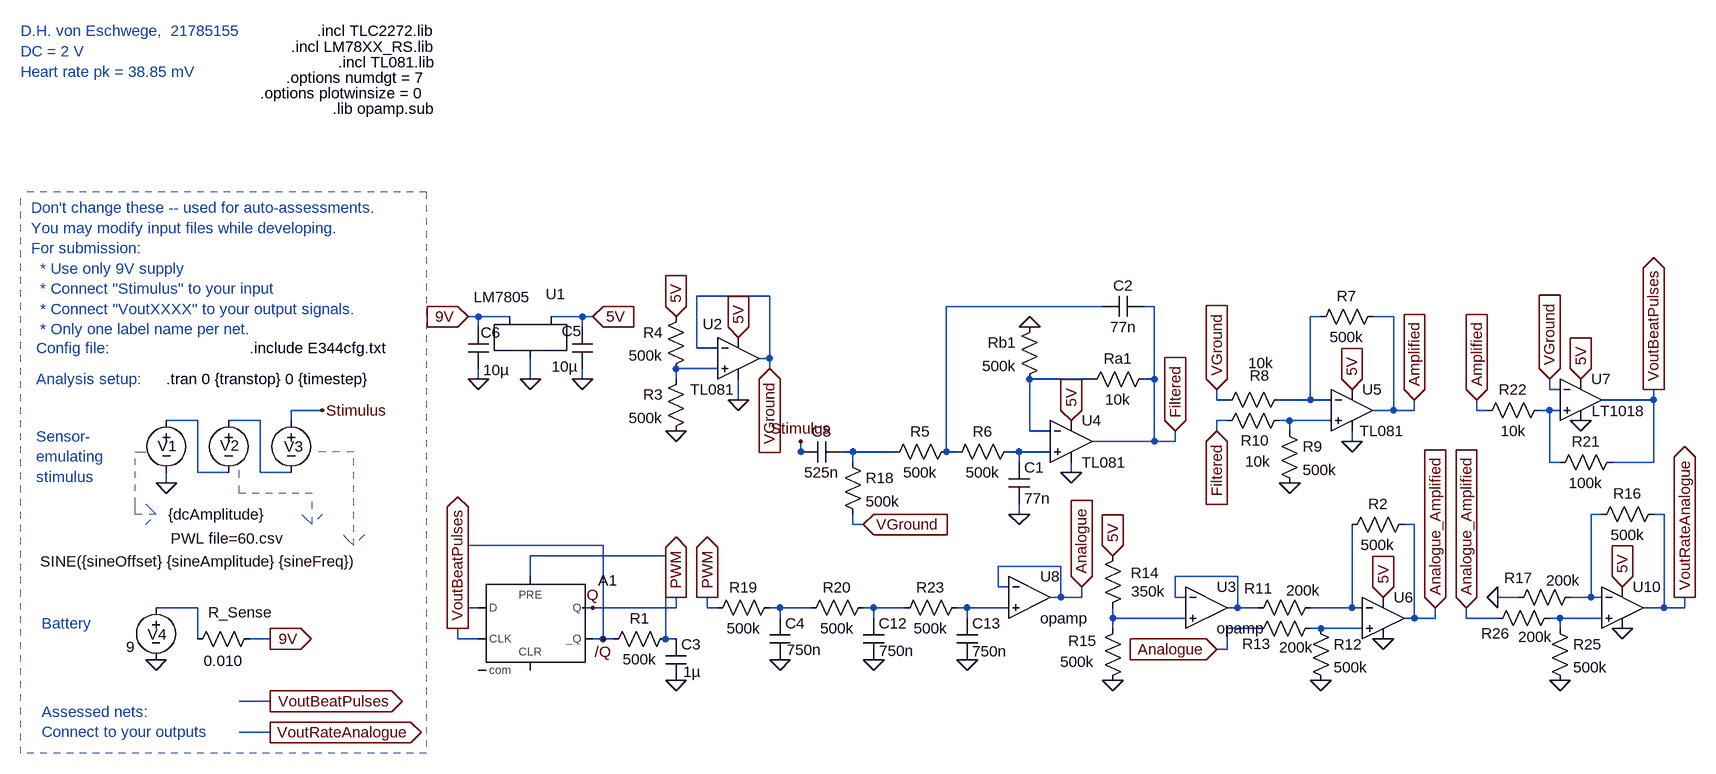
[diagram p0: schematic von_Eschwege_21785155_A2.asc]
von_Eschwege_21785155_A2.asc, the LTspice schematic file:
Version 4
SHEET 1 2292 680
WIRE -1152 -1248 -1264 -1248
WIRE -640 -1232 -880 -1232
WIRE -560 -1232 -576 -1232
WIRE -1600 -1216 -1616 -1216
WIRE -1552 -1216 -1600 -1216
WIRE -1440 -1216 -1488 -1216
WIRE -1424 -1216 -1440 -1216
WIRE -304 -1216 -320 -1216
WIRE -192 -1216 -224 -1216
WIRE -1600 -1200 -1600 -1216
WIRE -1440 -1200 -1440 -1216
WIRE -1264 -1168 -1264 -1248
WIRE -1232 -1168 -1264 -1168
WIRE -1152 -1152 -1152 -1248
WIRE -1152 -1152 -1168 -1152
WIRE -1232 -1136 -1296 -1136
WIRE -1152 -1136 -1152 -1152
WIRE -1600 -1120 -1600 -1136
WIRE -1520 -1120 -1520 -1152
WIRE -1440 -1120 -1440 -1136
WIRE -1296 -1120 -1296 -1136
WIRE -656 -1120 -752 -1120
WIRE -560 -1120 -560 -1232
WIRE -560 -1120 -576 -1120
WIRE 48 -1104 48 -1120
WIRE 64 -1104 48 -1104
WIRE -1200 -1088 -1200 -1120
WIRE -464 -1088 -464 -1104
WIRE -448 -1088 -464 -1088
WIRE -320 -1088 -320 -1216
WIRE -320 -1088 -368 -1088
WIRE -288 -1088 -320 -1088
WIRE 208 -1088 208 -1104
WIRE 208 -1088 128 -1088
WIRE -1840 -1072 -1888 -1072
WIRE -192 -1072 -192 -1216
WIRE -192 -1072 -224 -1072
WIRE -160 -1072 -160 -1088
WIRE -160 -1072 -192 -1072
WIRE -64 -1072 -64 -1088
WIRE -48 -1072 -64 -1072
WIRE 48 -1072 32 -1072
WIRE 64 -1072 48 -1072
WIRE -2032 -1056 -2080 -1056
WIRE -1936 -1056 -1984 -1056
WIRE -1888 -1056 -1888 -1072
WIRE -448 -1056 -464 -1056
WIRE -352 -1056 -368 -1056
WIRE -288 -1056 -352 -1056
WIRE -752 -1040 -752 -1120
WIRE -720 -1040 -752 -1040
WIRE -464 -1040 -464 -1056
WIRE -352 -1040 -352 -1056
WIRE -560 -1024 -560 -1120
WIRE -560 -1024 -656 -1024
WIRE -528 -1024 -528 -1040
WIRE -528 -1024 -560 -1024
WIRE -256 -1024 -256 -1040
WIRE -1104 -1008 -1104 -1024
WIRE -1088 -1008 -1104 -1008
WIRE -1024 -1008 -1040 -1008
WIRE -960 -1008 -1024 -1008
WIRE -880 -1008 -880 -1232
WIRE -864 -1008 -880 -1008
WIRE -768 -1008 -784 -1008
WIRE -720 -1008 -768 -1008
WIRE -1024 -992 -1024 -1008
WIRE -768 -992 -768 -1008
WIRE 48 -992 48 -1072
WIRE 64 -992 48 -992
WIRE 208 -992 208 -1088
WIRE 208 -992 144 -992
WIRE -2032 -976 -2032 -1056
WIRE -1984 -976 -2032 -976
WIRE -1936 -976 -1936 -1056
WIRE -1888 -976 -1936 -976
WIRE -688 -976 -688 -992
WIRE -2080 -960 -2080 -976
WIRE -768 -912 -768 -928
WIRE 128 -912 112 -912
WIRE 224 -912 208 -912
WIRE -1024 -896 -1024 -912
WIRE -1008 -896 -1024 -896
WIRE -160 -896 -176 -896
WIRE -1408 -864 -1616 -864
WIRE -1312 -848 -1520 -848
WIRE -704 -832 -800 -832
WIRE -1520 -816 -1520 -848
WIRE -432 -816 -528 -816
WIRE -800 -800 -800 -832
WIRE -784 -800 -800 -800
WIRE -704 -784 -704 -832
WIRE -704 -784 -720 -784
WIRE -672 -784 -672 -800
WIRE -672 -784 -704 -784
WIRE -528 -784 -528 -816
WIRE -512 -784 -528 -784
WIRE 0 -784 -32 -784
WIRE 112 -784 112 -912
WIRE 112 -784 80 -784
WIRE 128 -784 112 -784
WIRE -2032 -768 -2096 -768
WIRE -1616 -768 -1616 -864
WIRE -1600 -768 -1616 -768
WIRE -1424 -768 -1440 -768
WIRE -1296 -768 -1296 -784
WIRE -1296 -768 -1424 -768
WIRE -1248 -768 -1248 -784
WIRE -1232 -768 -1248 -768
WIRE -1136 -768 -1152 -768
WIRE -1088 -768 -1136 -768
WIRE -992 -768 -1008 -768
WIRE -944 -768 -992 -768
WIRE -848 -768 -864 -768
WIRE -784 -768 -848 -768
WIRE -432 -768 -432 -816
WIRE -432 -768 -448 -768
WIRE -400 -768 -432 -768
WIRE -256 -768 -256 -896
WIRE -256 -768 -320 -768
WIRE -240 -768 -256 -768
WIRE 224 -768 224 -912
WIRE 224 -768 192 -768
WIRE 256 -768 256 -784
WIRE 256 -768 224 -768
WIRE -1136 -752 -1136 -768
WIRE -992 -752 -992 -768
WIRE -848 -752 -848 -768
WIRE -624 -752 -624 -768
WIRE -512 -752 -624 -752
WIRE -160 -752 -160 -896
WIRE -160 -752 -176 -752
WIRE -128 -752 -128 -768
WIRE -128 -752 -160 -752
WIRE -80 -752 -80 -768
WIRE -32 -752 -80 -752
WIRE 64 -752 48 -752
WIRE 128 -752 64 -752
WIRE -624 -736 -624 -752
WIRE -400 -736 -448 -736
WIRE -304 -736 -320 -736
WIRE -240 -736 -304 -736
WIRE 64 -736 64 -752
WIRE -2032 -720 -2032 -768
WIRE -1920 -720 -1952 -720
WIRE -1632 -720 -1632 -736
WIRE -1600 -720 -1632 -720
WIRE -1408 -720 -1408 -864
WIRE -1408 -720 -1424 -720
WIRE -1392 -720 -1408 -720
WIRE -1312 -720 -1312 -848
WIRE -1296 -720 -1312 -720
WIRE -448 -704 -448 -736
WIRE -448 -704 -464 -704
WIRE -1920 -624 -1968 -624
WIRE -1920 -576 -1968 -576
FLAG -2080 -960 0
FLAG -1840 -1072 Stimulus
FLAG -1920 -720 9V
IOPIN -1920 -720 Out
FLAG -2096 -688 0
FLAG -1920 -624 VoutBeatPulses
IOPIN -1920 -624 Out
FLAG -1920 -576 VoutRateAnalogue
IOPIN -1920 -576 Out
FLAG -1520 -1120 0
FLAG -1616 -1216 9V
IOPIN -1616 -1216 In
FLAG -1600 -1120 0
FLAG -1440 -1120 0
FLAG -1424 -1216 5V
IOPIN -1424 -1216 In
FLAG -1296 -1040 0
FLAG -1296 -1216 5V
IOPIN -1296 -1216 In
FLAG -1200 -1088 0
FLAG -1200 -1184 5V
IOPIN -1200 -1184 In
FLAG -1152 -1136 VGround
IOPIN -1152 -1136 In
FLAG -688 -976 0
FLAG -768 -912 0
FLAG -752 -1200 0
FLAG -688 -1056 5V
IOPIN -688 -1056 In
FLAG -256 -1024 0
FLAG -352 -960 0
FLAG -256 -1104 5V
IOPIN -256 -1104 In
FLAG 96 -1120 5V
IOPIN 96 -1120 In
FLAG 96 -1056 0
FLAG -1104 -1024 Stimulus
FLAG -1008 -896 VGround
IOPIN -1008 -896 In
FLAG 208 -1104 VoutBeatPulses
IOPIN 208 -1104 Out
FLAG -1424 -768 Q
FLAG -1408 -720 /Q
FLAG -1296 -656 0
FLAG -1632 -736 VoutBeatPulses
IOPIN -1632 -736 Out
FLAG -528 -1040 Filtered
IOPIN -528 -1040 In
FLAG -464 -1040 Filtered
IOPIN -464 -1040 In
FLAG -160 -1088 Amplified
IOPIN -160 -1088 In
FLAG -64 -1088 Amplified
IOPIN -64 -1088 In
FLAG -464 -1104 VGround
IOPIN -464 -1104 In
FLAG 48 -1120 VGround
IOPIN 48 -1120 In
FLAG -1296 -784 PWM
IOPIN -1296 -784 Out
FLAG -1136 -688 0
FLAG -992 -688 0
FLAG -848 -688 0
FLAG -672 -800 Analogue
IOPIN -672 -800 In
FLAG -1248 -784 PWM
IOPIN -1248 -784 Out
FLAG -304 -656 0
FLAG -464 -704 Analogue
IOPIN -464 -704 In
FLAG -624 -656 0
FLAG -208 -784 5V
IOPIN -208 -784 In
FLAG -208 -720 0
FLAG -624 -848 5V
IOPIN -624 -848 In
FLAG 64 -656 0
FLAG 256 -784 VoutRateAnalogue
IOPIN 256 -784 Out
FLAG 160 -800 5V
IOPIN 160 -800 In
FLAG 160 -736 0
FLAG -128 -768 Analogue_Amplified
IOPIN -128 -768 In
FLAG -32 -784 0
FLAG -80 -768 Analogue_Amplified
IOPIN -80 -768 In
SYMBOL voltage -1984 -1072 R0
WINDOW 123 0 0 Left 0
WINDOW 39 0 0 Left 0
WINDOW 3 -89 197 Left 2
WINDOW 0 -13 54 Left 2
SYMATTR Value PWL file=60.csv
SYMATTR InstName V2
SYMBOL voltage -1888 -1072 R0
WINDOW 123 24 44 Left 2
WINDOW 39 0 0 Left 0
WINDOW 3 -386 233 Left 2
WINDOW 0 -11 56 Left 2
SYMATTR Value SINE({sineOffset} {sineAmplitude} {sineFreq})
SYMATTR InstName V3
SYMBOL voltage -2080 -1072 R0
WINDOW 123 0 0 Left 0
WINDOW 39 0 0 Left 0
WINDOW 3 3 160 Left 2
WINDOW 0 -13 55 Left 2
SYMATTR Value {dcAmplitude}
SYMATTR InstName V1
SYMBOL voltage -2096 -784 R0
WINDOW 123 24 44 Left 2
WINDOW 39 0 0 Left 0
WINDOW 3 -46 76 Left 2
WINDOW 0 -13 57 Left 2
SYMATTR Value 9
SYMATTR InstName V4
SYMBOL res -1936 -736 R90
WINDOW 0 -9 30 VBottom 2
WINDOW 3 34 56 VTop 2
SYMATTR InstName R_Sense
SYMATTR Value 0.010
SYMBOL LM7805 -1520 -1200 R0
WINDOW 0 39 -35 Bottom 2
WINDOW 3 -43 -62 Top 2
SYMATTR InstName U1
SYMBOL cap -1456 -1200 R0
WINDOW 0 -16 6 Left 2
WINDOW 3 -31 61 Left 2
SYMATTR InstName C5
SYMATTR Value 10µ
SYMBOL cap -1584 -1200 M0
WINDOW 0 -18 8 Left 2
WINDOW 3 -32 66 Left 2
SYMATTR InstName C6
SYMATTR Value 10µ
SYMBOL res -1280 -1136 M0
SYMATTR InstName R3
SYMATTR Value 500k
SYMBOL res -1280 -1232 M0
SYMATTR InstName R4
SYMATTR Value 500k
SYMBOL Opamps\\opamp2 -1200 -1216 R0
WINDOW 0 -55 11 Left 2
WINDOW 3 -74 112 Left 2
SYMATTR InstName U2
SYMATTR Value TL081
SYMBOL res -864 -1024 R90
WINDOW 0 0 56 VBottom 2
WINDOW 3 32 56 VTop 2
SYMATTR InstName R5
SYMATTR Value 500k
SYMBOL cap -784 -992 R0
SYMATTR InstName C1
SYMATTR Value 77n
SYMBOL Opamps\\opamp2 -688 -1088 R0
SYMATTR InstName U4
SYMATTR Value TL081
SYMBOL res -768 -1024 R90
WINDOW 0 0 56 VBottom 2
WINDOW 3 32 56 VTop 2
SYMATTR InstName R6
SYMATTR Value 500k
SYMBOL res -560 -1136 R90
WINDOW 0 0 56 VBottom 2
WINDOW 3 32 56 VTop 2
SYMATTR InstName Ra1
SYMATTR Value 10k
SYMBOL res -736 -1216 M0
SYMATTR InstName Rb1
SYMATTR Value 500k
SYMBOL cap -576 -1248 R90
WINDOW 0 0 32 VBottom 2
WINDOW 3 32 32 VTop 2
SYMATTR InstName C2
SYMATTR Value 77n
SYMBOL res -208 -1232 R90
WINDOW 0 0 56 VBottom 2
WINDOW 3 32 56 VTop 2
SYMATTR InstName R7
SYMATTR Value 500k
SYMBOL res -352 -1104 R90
WINDOW 0 -6 46 VBottom 2
WINDOW 3 -56 44 VTop 2
SYMATTR InstName R8
SYMATTR Value 10k
SYMBOL Opamps\\opamp2 -256 -1136 R0
WINDOW 3 12 96 Left 2
SYMATTR Value TL081
SYMATTR InstName U5
SYMBOL res -368 -1056 R0
SYMATTR InstName R9
SYMATTR Value 500k
SYMBOL res -352 -1072 R90
WINDOW 0 62 53 VBottom 2
WINDOW 3 63 49 VTop 2
SYMATTR InstName R10
SYMATTR Value 10k
SYMBOL Comparators\\LT1018 96 -1088 R0
WINDOW 3 17 17 Left 2
SYMATTR InstName U7
SYMBOL cap -1040 -992 M270
WINDOW 0 32 32 VTop 2
WINDOW 3 0 32 VBottom 2
SYMATTR InstName C8
SYMATTR Value 525n
SYMBOL res -1040 -1008 R0
SYMATTR InstName R18
SYMATTR Value 500k
SYMBOL res 160 -1008 R90
WINDOW 0 0 56 VBottom 2
WINDOW 3 32 56 VTop 2
SYMATTR InstName R21
SYMATTR Value 100k
SYMBOL res 48 -1088 R90
WINDOW 0 0 56 VBottom 2
WINDOW 3 32 56 VTop 2
SYMATTR InstName R22
SYMATTR Value 10k
SYMBOL Digital\\dflop -1520 -816 R0
SYMATTR InstName A1
SYMATTR SpiceLine Vhigh 5 Trise 10n
SYMBOL res -1296 -736 R90
WINDOW 0 0 56 VBottom 2
WINDOW 3 32 56 VTop 2
SYMATTR InstName R1
SYMATTR Value 500k
SYMBOL cap -1312 -720 R0
WINDOW 3 27 51 Left 2
SYMATTR Value 1µ
SYMATTR InstName C3
SYMBOL res -1136 -784 R90
WINDOW 0 0 56 VBottom 2
WINDOW 3 32 56 VTop 2
SYMATTR InstName R19
SYMATTR Value 500k
SYMBOL cap -1152 -752 R0
WINDOW 3 26 49 Left 2
SYMATTR Value 750n
SYMATTR InstName C4
SYMBOL res -992 -784 R90
WINDOW 0 0 56 VBottom 2
WINDOW 3 32 56 VTop 2
SYMATTR InstName R20
SYMATTR Value 500k
SYMBOL cap -1008 -752 R0
WINDOW 3 25 50 Left 2
SYMATTR Value 750n
SYMATTR InstName C12
SYMBOL res -848 -784 R90
WINDOW 0 0 56 VBottom 2
WINDOW 3 32 56 VTop 2
SYMATTR InstName R23
SYMATTR Value 500k
SYMBOL cap -864 -752 R0
WINDOW 3 24 51 Left 2
SYMATTR Value 750n
SYMATTR InstName C13
SYMBOL res -160 -912 R90
WINDOW 0 0 56 VBottom 2
WINDOW 3 32 56 VTop 2
SYMATTR InstName R2
SYMATTR Value 500k
SYMBOL res -304 -784 R90
WINDOW 0 2 96 VBottom 2
WINDOW 3 -26 27 VTop 2
SYMATTR InstName R11
SYMATTR Value 200k
SYMBOL res -320 -752 R0
SYMATTR InstName R12
SYMATTR Value 500k
SYMBOL res -304 -752 R90
WINDOW 0 55 99 VBottom 2
WINDOW 3 29 38 VTop 2
SYMATTR InstName R13
SYMATTR Value 200k
SYMBOL res -608 -864 M0
WINDOW 0 -56 42 Left 2
WINDOW 3 -65 71 Left 2
SYMATTR InstName R14
SYMATTR Value 350k
SYMATTR SpiceLine tol=60k
SYMBOL res -608 -752 M0
WINDOW 0 40 35 Left 2
WINDOW 3 44 67 Left 2
SYMATTR InstName R15
SYMATTR Value 500k
SYMBOL OpAmps\\opamp -480 -832 R0
SYMATTR InstName U3
SYMBOL OpAmps\\UniversalOpamp2 -208 -752 R0
SYMATTR InstName U6
SYMBOL OpAmps\\opamp -752 -848 R0
SYMATTR InstName U8
SYMBOL res 224 -928 R90
WINDOW 0 0 56 VBottom 2
WINDOW 3 32 56 VTop 2
SYMATTR InstName R16
SYMATTR Value 500k
SYMBOL res 96 -800 R90
WINDOW 0 2 96 VBottom 2
WINDOW 3 -26 27 VTop 2
SYMATTR InstName R17
SYMATTR Value 200k
SYMBOL res 48 -752 R0
SYMATTR InstName R25
SYMATTR Value 500k
SYMBOL res 64 -768 R90
WINDOW 0 55 99 VBottom 2
WINDOW 3 29 38 VTop 2
SYMATTR InstName R26
SYMATTR Value 200k
SYMBOL OpAmps\\UniversalOpamp2 160 -768 R0
SYMATTR InstName U10
TEXT -2080 -1120 Left 2 !.tran 0 {transtop} 0 {timestep}
TEXT -1952 -1168 Left 2 !.include E344cfg.txt
TEXT -2288 -1384 Left 2 ;Don't change these -- used for auto-assessments.\nYou may modify input files while developing.\nFor submission: \n  * Use only 9V supply \n  * Connect "Stimulus" to your input\n  * Connect "VoutXXXX" to your output signals.\n  * Only one label name per net.
TEXT -2280 -1168 Left 2 ;Config file:
TEXT -2280 -1120 Left 2 ;Analysis setup:
TEXT -2272 -744 Left 2 ;Battery
TEXT -2280 -1032 Left 2 ;Sensor-\nemulating \nstimulus
TEXT -2272 -608 Left 2 ;Assessed nets:\nConnect to your outputs
TEXT -2304 -1656 Left 2 ;D.H. von Eschwege,  21785155\nDC = 2 V\nHeart rate pk = 38.85 mV
TEXT -1848 -1656 Left 2 !.incl TLC2272.lib
TEXT -1888 -1632 Left 2 !.incl LM78XX_RS.lib
TEXT -1816 -1608 Left 2 !.incl TL081.lib
TEXT -1896 -1584 Left 2 !.options numdgt = 7
TEXT -1936 -1560 Left 2 !.options plotwinsize = 0
TEXT -1824 -1536 Left 2 !.lib opamp.sub
LINE Normal -1792 -1008 -1856 -1008 2
LINE Normal -1792 -864 -1792 -1008 2
LINE Normal -1808 -880 -1792 -864 2
LINE Normal -1792 -864 -1808 -880 2
LINE Normal -1776 -880 -1792 -864 2
LINE Normal -2128 -1008 -2112 -1008 2
LINE Normal -2128 -928 -2128 -1008 2
LINE Normal -2128 -912 -2128 -928 2
LINE Normal -2096 -912 -2128 -912 2
LINE Normal -2112 -928 -2096 -912 2
LINE Normal -2096 -912 -2112 -928 2
LINE Normal -2112 -896 -2096 -912 2
LINE Normal -1968 -944 -1968 -992 2
LINE Normal -1856 -944 -1968 -944 2
LINE Normal -1856 -896 -1856 -944 2
LINE Normal -1872 -912 -1856 -896 2
LINE Normal -1856 -896 -1872 -912 2
LINE Normal -1840 -912 -1856 -896 2
LINE Normal -2304 -544 -2304 -1408 1
LINE Normal -1680 -1408 -1680 -544 1
LINE Normal -1680 -544 -2304 -544 1
LINE Normal -1680 -1408 -2304 -1408 1

The netlist it stands for:
* von_Eschwege_21785155_A2.asc
V2 N007 N006 PWL file=60.csv
V3 Stimulus N007 SINE({sineOffset} {sineAmplitude} {sineFreq})
V1 N006 0 {dcAmplitude}
V4 N014 0 9
R_Sense 9V N014 0.010
XU1 9V 0 5V LM7805
C5 5V 0 10µ
C6 9V 0 10µ
R3 N003 0 500k
R4 5V N003 500k
XU2 N003 VGround 5V 0 VGround TL081  ; pins In+ In- V+ V- OUT
R5 N001 N009 500k
C1 N010 0 77n
XU4 N010 N004 5V 0 Filtered TL081  ; pins In+ In- V+ V- OUT
R6 N010 N001 500k
Ra1 Filtered N004 10k
Rb1 0 N004 500k
C2 Filtered N001 77n
R7 Amplified N002 500k
R8 N002 VGround 10k
XU5 N008 N002 5V 0 Amplified TL081  ; pins In+ In- V+ V- OUT
R9 N008 0 500k
R10 N008 Filtered 10k
XU7 N005 VGround 5V 0 VoutBeatPulses LT1018  ; pins In+ In- V+ V- OUT
C8 N009 Stimulus 525n
R18 N009 VGround 500k
R21 VoutBeatPulses N005 100k
R22 N005 Amplified 10k
A1 /Q 0 VoutBeatPulses N012 0 /Q PWM 0 DFLOP Vhigh 5 Trise 10n
R1 N012 /Q 500k
C3 N012 0 1µ
R19 N015 PWM 500k
C4 N015 0 750n
R20 N016 N015 500k
C12 N016 0 750n
R23 N017 N016 500k
C13 N017 0 750n
R2 Analogue_Amplified N018 500k
R11 N018 N013 200k
R12 N021 0 500k
R13 N021 Analogue 200k
R14 5V N019 350k tol=60k
R15 N019 0 500k
XU3 N013 N019 N013 opamp Aol=100K GBW=10Meg  ; pins invin noninvin out
XU6 N021 N018 5V 0 Analogue_Amplified level.2 Avol=1Meg GBW=10Meg Slew=10Meg ilimit=25m rail=0 Vos=0 phimargin=45 en=0 enk=0 in=0 ink=0 Rin=500Meg  ; pins IN+ IN- V+ V- OUT
XU8 Analogue N017 Analogue opamp Aol=100K GBW=10Meg  ; pins invin noninvin out
R16 VoutRateAnalogue N011 500k
R17 N011 0 200k
R25 N020 0 500k
R26 N020 Analogue_Amplified 200k
XU10 N020 N011 5V 0 VoutRateAnalogue level.2 Avol=1Meg GBW=10Meg Slew=10Meg ilimit=25m rail=0 Vos=0 phimargin=45 en=0 enk=0 in=0 ink=0 Rin=500Meg  ; pins IN+ IN- V+ V- OUT
.tran 0 {transtop} 0 {timestep}
.include E344cfg.txt
* Don't change these -- used for auto-assessments.
* You may modify input files while developing.
* For submission:
*   * Use only 9V supply
*   * Connect "Stimulus" to your input
*   * Connect "VoutXXXX" to your output signals.
*   * Only one label name per net.
* Config file:
* Analysis setup:
* Battery
* Sensor-
* emulating
* stimulus
* Assessed nets:
* Connect to your outputs
* D.H. von Eschwege,  21785155
* DC = 2 V
* Heart rate pk = 38.85 mV
.incl TLC2272.lib
.incl LM78XX_RS.lib
.incl TL081.lib
.options numdgt = 7
.options plotwinsize = 0
.lib opamp.sub
.lib LTC1.lib
.lib UniversalOpamps2.sub
.backanno
.end